# Altium schematic sheet CAN.SchDoc
size A4
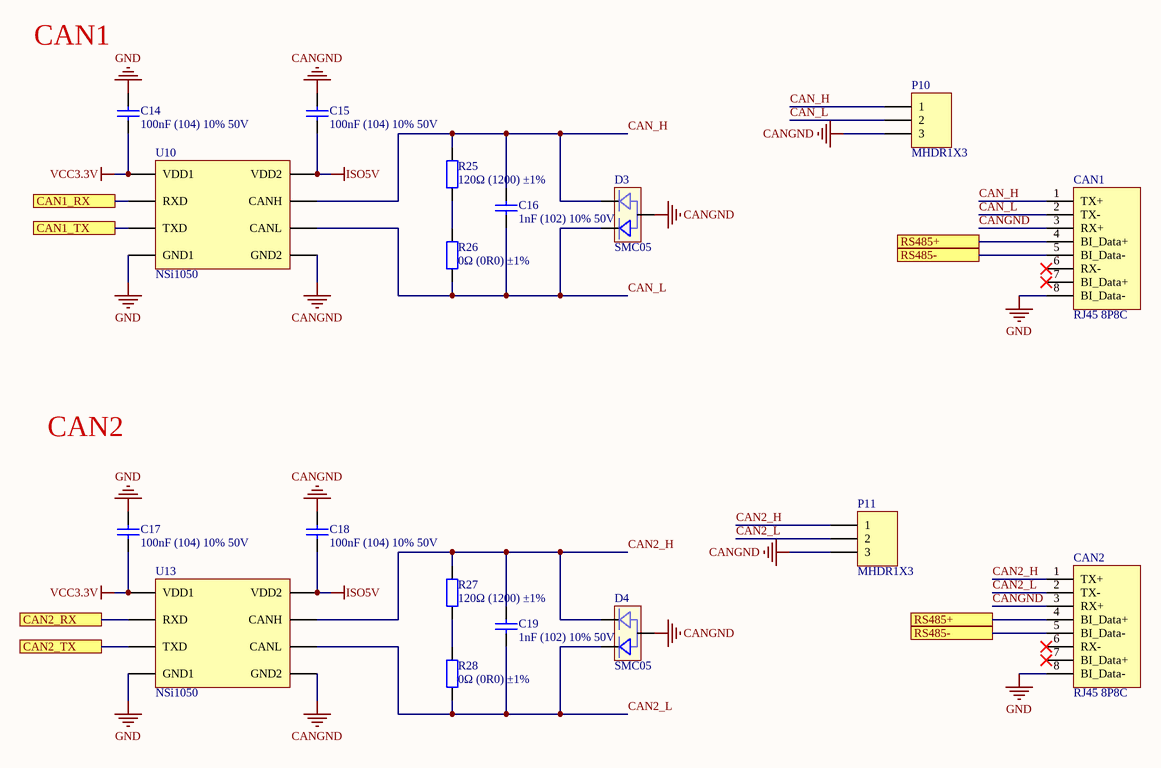
[diagram p0: CAN.SchDoc]

## Parts
C14  100nF (104) 10% 50V  [0402_C]
C15  100nF (104) 10% 50V  [0402_C]
C16  1nF (102) 10% 50V  [0402_C]
C17  100nF (104) 10% 50V  [0402_C]
C18  100nF (104) 10% 50V  [0402_C]
C19  1nF (102) 10% 50V  [0402_C]
CAN1  RJ45 8P8C  [RJ45-8P8C]
CAN2  RJ45 8P8C  [RJ45-8P8C]
D3  SMC05  [SOT-23]
D4  SMC05  [SOT-23]
P10  MHDR1X3  [SH1.0-3P-L]
P11  MHDR1X3  [SH1.0-3P-L]
R25  120Ω (1200) ±1%  [0402_R]
R26  0Ω (0R0) ±1%  [0402_R]
R27  120Ω (1200) ±1%  [0402_R]
R28  0Ω (0R0) ±1%  [0402_R]
U10  NSi1050  [SOP8-W2.54]
U13  NSi1050  [SOP8-W2.54]

## Ports
CAN1_RX, CAN1_TX, CAN2_RX, CAN2_TX, RS485+, RS485-

## Nets
CANGND: C15.1 C18.1 CAN1.3(RX+) CAN2.3(RX+) D3.3 D4.3 P10.3 P11.3 U10.5(GND2) U13.5(GND2)
GND: C14.1 C17.1 CAN1.8(BI_Data-) CAN2.8(BI_Data-) U10.4(GND1) U13.4(GND1)
ISO5V: C15.2 C18.2 U10.8(VDD2) U13.8(VDD2)
VCC3.3V: C14.2 C17.2 U10.1(VDD1) U13.1(VDD1)
CAN1_RX: U10.2(RXD) ; port CAN1_RX
CAN1_TX: U10.3(TXD) ; port CAN1_TX
CAN2_H: C19.2 CAN2.1(TX+) D4.1 P11.1 R27.2 U13.7(CANH)
CAN2_L: C19.1 CAN2.2(TX-) D4.2 P11.2 R28.1 U13.6(CANL)
CAN2_RX: U13.2(RXD) ; port CAN2_RX
CAN2_TX: U13.3(TXD) ; port CAN2_TX
CAN_H: C16.2 CAN1.1(TX+) D3.1 P10.1 R25.2 U10.7(CANH)
CAN_L: C16.1 CAN1.2(TX-) D3.2 P10.2 R26.1 U10.6(CANL)
RS485+: CAN1.4(BI_Data+) CAN2.4(BI_Data+) ; port RS485+
RS485-: CAN1.5(BI_Data-) CAN2.5(BI_Data-) ; port RS485-
NetR25_1: R25.1 R26.2
NetR27_1: R27.1 R28.2

Not connected (* = marked no-connect by the designer): CAN1 6(RX-)* 7(BI_Data+)*; CAN2 6(RX-)* 7(BI_Data+)*

## Notes on the sheet
- CAN1
- CAN2

## Library data of the parts
C14 C15 C17 C18 = 0603 100nF (104) 10% 50V: 贴片电容; ComponentLink1Description: 供应商链接; ComponentLink1URL: http://www.szlcsc.com/product/details_15331.html; Package: 0603; Supplier: LC; SuppliersPartNumber: C14663
C16 C19 = 0603 1nF (102) 10% 50V: 贴片电容; ComponentLink1Description: 供应商链接; ComponentLink1URL: http://www.szlcsc.com/product/details_1940.html; Package: 0603; Supplier: LC; SuppliersPartNumber: C1588
CAN1 CAN2 = RJ45-8P8C: 以太网接口
D3 D4 = Diode-TVS: 瞬态抑制二极管
P10 P11 = MHDR1X3: Header, 3-Pin; LatestRevisionDate: 17-Jul-2002; LatestRevisionNote: Re-released for DXP Platform.; Publisher: Altium Limited
R25 R27 = 0603 120Ω (1200) 1%: 贴片电阻; ComponentLink1Description: 供应商链接; ComponentLink1URL: http://www.szlcsc.com/product/details_23514.html; Package: 0603; Supplier: LC; SuppliersPartNumber: C22787
R26 R28 = 0603 0Ω (0R0) 1%: 贴片电阻; ComponentLink1Description: 供应商链接; ComponentLink1URL: http://www.szlcsc.com/product/details_21903.html; Package: 0603; Supplier: LC; SuppliersPartNumber: C21189
U10 U13 = NSi1050: CAN隔离收发器